# Altium schematic sheet SingleCycleIntrruptSupted.SchDoc
size 281 x 215 mm
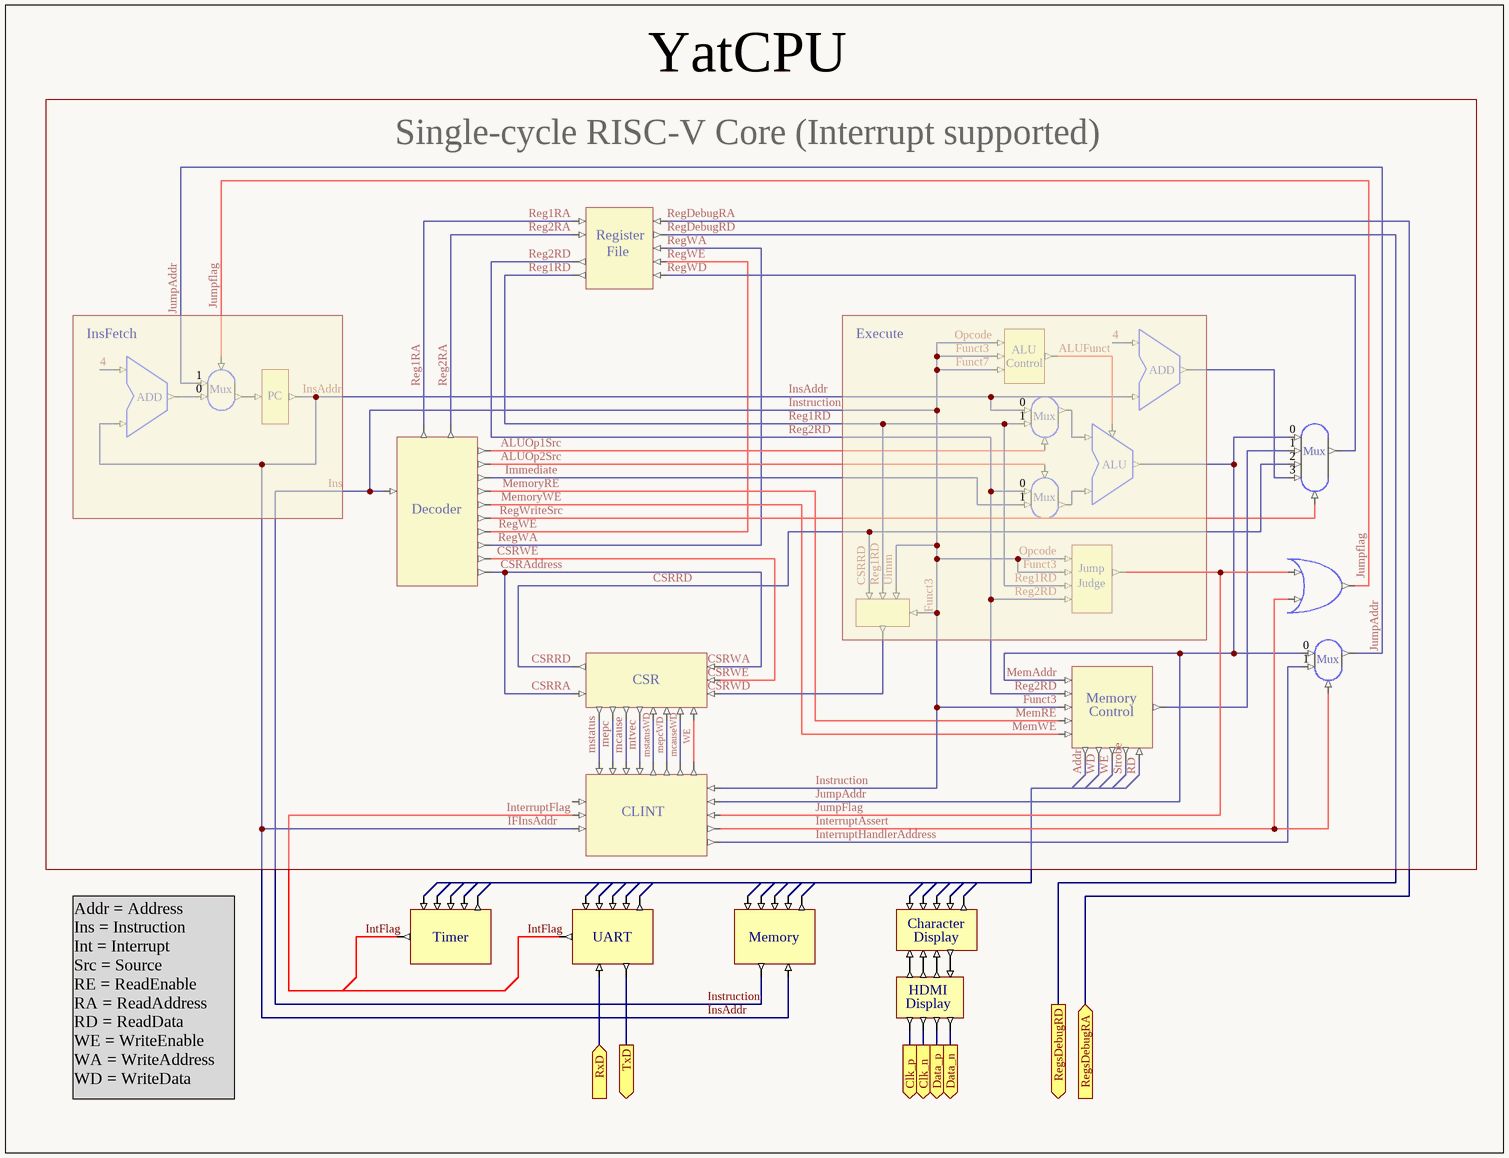
[diagram p0: SingleCycleIntrruptSupted.SchDoc]

## Parts
(Parts that share a designator on the sheet are numbered #1, #2 ... from top to bottom, then left to right.)
*#1  RegFile  (value not drawn)
*#2  ALUControl  (value not drawn)
*#3  ADD  (value not drawn)
*#4  ADD  (value not drawn)
*#5  Mux2  (value not drawn)
*#6  Mux2‘  (value not drawn)
*#7  ALU  (value not drawn)
*#8  Mux4  (value not drawn)
*#9  JumpJudge  (value not drawn)
*#10  OR  (value not drawn)
*#11  CSRCompute  (value not drawn)
*#12  Mux2‘  (value not drawn)
*#13  CSR  (value not drawn)
*#14  MemoryControl  (value not drawn)
*#15  CLINT  (value not drawn)
*#16  Timer  (value not drawn)
*#17  UART  (value not drawn)
*#18  Memory  (value not drawn)
*#19  CharacterDisplay  (value not drawn)
*#20  HDMIDisplay  (value not drawn)
*?  Mux2  (value not drawn)
ID  ID  (value not drawn)
Reg1  PC

## Blocks framed on the sheet
YatCPU: *#1-*#15 *? ID Reg1

## Ports
Clk_n (out), Clk_p (out), Data_n (out), Data_p (out), RegsDebugRA (in), RegsDebugRD (out), RxD (in), TxD (out)

## Nets
4: *#3.0(in0) *#4.0(in0)
Addr: *#14.10
ALUFunct: *#2.41 *#7.3
ALUOp1Src: *#6.3(select) ID.22
ALUOp2Src: *?.3(select) ID.14
Clk_n: *#20.47 ; port Clk_n
Clk_p: *#20.46 ; port Clk_p
CSRAddress: *#13.22 *#13.28 ID.23  [also labelled CSRRA]
CSRRD: *#8.2(in1) *#11.37 *#13.27
CSRWE: *#13.23 ID.21
Data_n: *#20.45 ; port Data_n
Data_p: *#20.48 ; port Data_p
Funct3: *#2.38 *#2.39 *#2.40 *#9.38 *#9.39 *#11.38 *#11.39 *#14.6 *#15.26 *#18.45 ID.11  [also labelled Funct7, Ins, Instruction, Opcode, Uimm]
IFInsAddr: *#3.1(in1) *#4.1(in1) *#6.0(in0) *#15.28 *#18.46 Reg1.1(OUT)  [also labelled InsAddr]
Immediate: *?.1(in1) ID.15
InterruptAssert: *#10.2 *#12.3(select) *#15.24
InterruptFlag: *#15.29
InterruptHandlerAddress: *#12.1(in1) *#15.25
JumpAddr: *#5.1(in0) *#7.2(out) *#8.0(in0) *#12.0(in0) *#12.2(out) *#14.4 *#15.22  [also labelled MemAddr]
JumpFlag: *#5.3(select) *#9.40 *#10.1 *#10.3 *#15.23
mcause: *#13.30 *#15.16
mcauseWD: *#13.34 *#15.20
MemoryRE: *#14.7 ID.16  [also labelled MemRE]
MemoryWE: *#14.8 ID.17  [also labelled MemWE]
mepc: *#13.29 *#15.15
mepcWD: *#13.33 *#15.19
mstatus: *#13.29 *#15.15
mstatusWD: *#13.32 *#15.18
mtvec: *#13.31 *#15.17
RD: *#14.13
Reg1RA: *#1.28 ID.12
Reg1RD: *#1.31 *#6.1(in1) *#9.36 *#11.36
Reg2RA: *#1.29 ID.13
Reg2RD: *#1.30 *#9.37 *#14.5 *?.0(in0)
RegDebugRA: *#1.35 ; port RegsDebugRA
RegDebugRD: *#1.36 ; port RegsDebugRD
RegWA: *#1.32 ID.20
RegWD: *#1.34 *#8.4(out)
RegWE: *#1.33 ID.19
RegWriteSrc: *#8.5(select) ID.18
RxD: *#17.46 ; port RxD
Strobe: *#14.11
TxD: *#17.47 ; port TxD
WD: *#14.14
WE: *#13.35 *#14.12 *#15.21
Net*#3_2: *#3.2(out) *#8.3(in3)
Net*#4_2: *#4.2(out) *#5.0(in1)
Net*#5_2: *#5.2(out) Reg1.0(IN)
Net*#6_2: *#6.2(out) *#7.0(in0)
Net*#7_1: *#7.1(in1) *?.2(out)
Net*#8_1: *#8.1(in1) *#14.9
Net*#11_40: *#11.40 *#13.24
Net*#19_45: *#19.45 *#20.44
Net*#19_46: *#19.46 *#20.43
Net*#19_47: *#19.47 *#20.43
Net*#19_48: *#19.48 *#20.43

Not connected (* = marked no-connect by the designer): *#15 27; *#16 43 44 45; *#17 43 44 45; *#18 43 44; *#19 43 44

## Notes on the sheet
- Single-cycle RISC-V Core (Interrupt supported)
- Addr = Address
  Ins = Instruction
  Int = Interrupt
  Src = Source
  RE = ReadEnable
  RA = ReadAddress
  RD = ReadData
  WE = WriteEnable
  WA = WriteAddress
  WD = WriteData
- Labels drawn without touching a wire or pin: CSRWA, CSRWD, CSRWE, Execute, InsFetch, IntFlag, Opcode
- (in symbol ALUControl) ALU; Control
- (in symbol CharacterDisplay) Character; Display
- (in symbol HDMIDisplay) HDMI; Display
- (in symbol ID) Decoder
- (in symbol JumpJudge) Jump; Judge
- (in symbol MemoryControl) Memory; Control
- (in symbol Mux2) Mux
- (in symbol Mux2‘) Mux
- (in symbol Mux4) Mux
- (in symbol RegFile) Register; File

## Library data of the parts
Reg1 = Reg